# EasyEDA schematic schematic.json
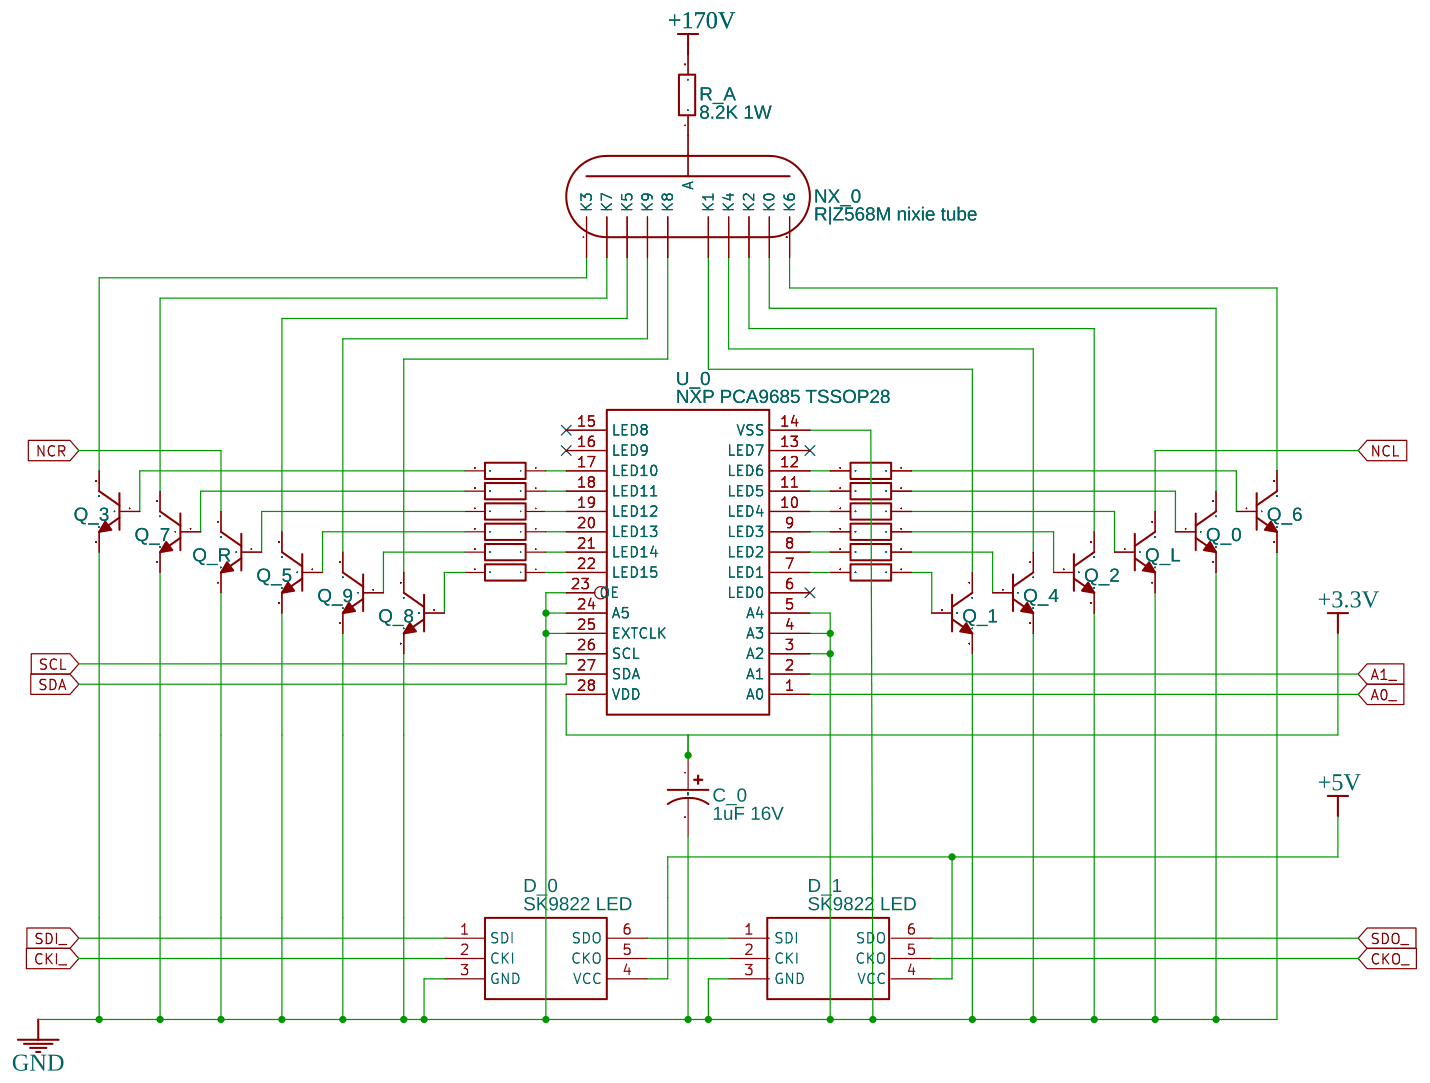
[diagram p0: schematic sheet]

## Parts
C_0  1uF 16V  [C0603]
D_0  SK9822 LED  [SK9822 LED]
D_1  SK9822 LED  [SK9822 LED]
NX_0  R|Z568M nixie tube  [R|Z568M NIXIE TUBE BOTTOM VIEW]
Q_0  SMMBTA42LT1G  [SOT-23-3_L2.9-W1.6-P1.90-LS2.8-BR]
Q_1  SMMBTA42LT1G  [SOT-23-3_L2.9-W1.6-P1.90-LS2.8-BR]
Q_2  SMMBTA42LT1G  [SOT-23-3_L2.9-W1.6-P1.90-LS2.8-BR]
Q_3  SMMBTA42LT1G  [SOT-23-3_L2.9-W1.6-P1.90-LS2.8-BR]
Q_4  SMMBTA42LT1G  [SOT-23-3_L2.9-W1.6-P1.90-LS2.8-BR]
Q_5  SMMBTA42LT1G  [SOT-23-3_L2.9-W1.6-P1.90-LS2.8-BR]
Q_6  SMMBTA42LT1G  [SOT-23-3_L2.9-W1.6-P1.90-LS2.8-BR]
Q_7  SMMBTA42LT1G  [SOT-23-3_L2.9-W1.6-P1.90-LS2.8-BR]
Q_8  SMMBTA42LT1G  [SOT-23-3_L2.9-W1.6-P1.90-LS2.8-BR]
Q_9  SMMBTA42LT1G  [SOT-23-3_L2.9-W1.6-P1.90-LS2.8-BR]
Q_L  SMMBTA42LT1G  [SOT-23-3_L2.9-W1.6-P1.90-LS2.8-BR]
Q_R  SMMBTA42LT1G  [SOT-23-3_L2.9-W1.6-P1.90-LS2.8-BR]
R_0  1K 1/10W  [R0603]
R_1  1K 1/10W  [R0603]
R_2  1K 1/10W  [R0603]
R_3  1K 1/10W  [R0603]
R_4  1K 1/10W  [R0603]
R_5  1K 1/10W  [R0603]
R_6  1K 1/10W  [R0603]
R_7  1K 1/10W  [R0603]
R_8  1K 1/10W  [R0603]
R_9  1K 1/10W  [R0603]
R_A  8.2K 1W  [R2512]
R_L  1K 1/10W  [R0603]
R_R  1K 1/10W  [R0603]
U_0  NXP PCA9685 TSSOP28  [SOT361-1]

## Library data of the parts
C_0 = C_Tan_SMD_A_US: Supplier Part: 399-11133-1-ND; Supplier: Digi-Key; Contributor: LCEDA_Lib; Manufacturer Part: C0603C105K8RACTU; Manufacturer: KEMET
D_0 D_1 = SK9822 LED: Manufacturer: Adafruit; Manufacturer Part: 2343; Supplier: Digi-Key; Supplier Part: 1528-1436-ND; link: https://www.digikey.com/products/en?mpart=2343&v=1528; Contributor: rossetyler
NX_0 = R|Z568M nixie tube: link: http://docs.daliborfarny.com/documentation/tube-socket/; Contributor: rossetyler
Q_0-Q_9 Q_L Q_R = MMBTA42LT1G: Supplier: Digi-Key; Manufacturer: ON Semiconductor; Supplier Part: SMMBTA42LT1GOSCT-ND; link: https://www.digikey.com/product-detail/en/on-semiconductor/SMMBTA42LT1G/SMMBTA42LT1GOSCT-ND/8538921
R_0-R_9 R_L R_R = CR0805-FX-1001ELF: Supplier: Digi-Key; Supplier Part: 541-1.00KHCT-ND; Manufacturer: Vishay Dale; Manufacturer Part: CRCW06031K00FKEA; Contributor: LCSC; link: https://www.digikey.com/product-detail/en/vishay-dale/CRCW06031K00FKEA/541-1-00KHCT-ND/1179809
R_A = CR2512F8K2E04: Supplier: Digi-Key; Supplier Part: 541-8.2KXCT-ND; Manufacturer: Vishay Dale; Manufacturer Part: CRCW25128K20JNEG; Contributor: LCSC; link: https://www.digikey.com/product-detail/en/vishay-dale/CRCW25128K20JNEG/541-8-2KXCT-ND/1178603
U_0 = NXP PCA9685 TSSOP28: Manufacturer: NXP USA Inc.; Manufacturer Part: PCA9685PW/Q900,118; Supplier: Digi-Key; Supplier Part: 568-5931-1-ND; link: https://www.digikey.com/product-detail/en/nxp-usa-inc/PCA9685PW-Q900-118/568-5931-1-ND/2531218; Contributor: rossetyler

## Nets
+3.3V: C_0.1 U_0.28(VDD)
+5V: D_0.4(VCC) D_1.4(VCC)
+170V: R_A.2
GND: C_0.2 D_0.3(GND) D_1.3(GND) Q_0.2 Q_1.2 Q_2.2 Q_3.2 Q_4.2 Q_5.2 Q_6.2 Q_7.2 Q_8.2 Q_9.2 Q_L.2 Q_R.2 U_0.3(A2) U_0.4(A3) U_0.5(A4) U_0.14(VSS) U_0.23(OE) U_0.24(A5) U_0.25(EXTCLK)
A0_: U_0.1(A0)
A1_: U_0.2(A1)
CKI_: D_0.2(CKI)
CKO_: D_1.5(CKO)
NCL: Q_L.3
NCR: Q_R.3
SCL: U_0.26(SCL)
SDA: U_0.27(SDA)
SDI_: D_0.1(SDI)
SDO_: D_1.6(SDO)
Net-(D_0-5): D_0.5(CKO) D_1.2(CKI)
Net-(D_0-6): D_0.6(SDO) D_1.1(SDI)
Net-(NX_0-1): NX_0.1(K1) Q_1.3
Net-(NX_0-2): NX_0.2(K4) Q_4.3
Net-(NX_0-3): NX_0.3(K2) Q_2.3
Net-(NX_0-4): NX_0.4(K0) Q_0.3
Net-(NX_0-5): NX_0.5(K6) Q_6.3
Net-(NX_0-6): NX_0.6(A) R_A.1
Net-(NX_0-7): NX_0.7(K3) Q_3.3
Net-(NX_0-8): NX_0.8(K7) Q_7.3
Net-(NX_0-9): NX_0.9(K5) Q_5.3
Net-(NX_0-10): NX_0.10(K9) Q_9.3
Net-(NX_0-11): NX_0.11(K8) Q_8.3
Net-(Q_0-1): Q_0.1 R_0.1
Net-(Q_1-1): Q_1.1 R_1.1
Net-(Q_2-1): Q_2.1 R_2.1
Net-(Q_3-1): Q_3.1 R_3.2
Net-(Q_4-1): Q_4.1 R_4.1
Net-(Q_5-1): Q_5.1 R_5.2
Net-(Q_6-1): Q_6.1 R_6.1
Net-(Q_7-1): Q_7.1 R_7.2
Net-(Q_8-1): Q_8.1 R_8.2
Net-(Q_9-1): Q_9.1 R_9.2
Net-(Q_L-1): Q_L.1 R_L.1
Net-(Q_R-1): Q_R.1 R_R.2
Net-(R_0-2): R_0.2 U_0.11(LED5)
Net-(R_1-2): R_1.2 U_0.7(LED1)
Net-(R_2-2): R_2.2 U_0.9(LED3)
Net-(R_3-1): R_3.1 U_0.17(LED10)
Net-(R_4-2): R_4.2 U_0.8(LED2)
Net-(R_5-1): R_5.1 U_0.20(LED13)
Net-(R_6-2): R_6.2 U_0.12(LED6)
Net-(R_7-1): R_7.1 U_0.18(LED11)
Net-(R_8-1): R_8.1 U_0.22(LED15)
Net-(R_9-1): R_9.1 U_0.21(LED14)
Net-(R_L-2): R_L.2 U_0.10(LED4)
Net-(R_R-1): R_R.1 U_0.19(LED12)

Not connected (* = marked no-connect by the designer): U_0 6(LED0)* 13(LED7)* 15(LED8)* 16(LED9)*
